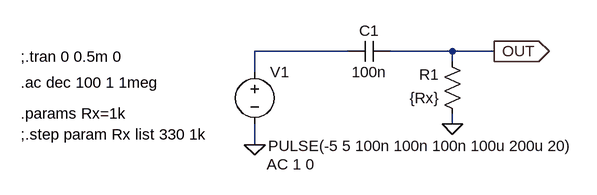
[diagram p0: schematic CR.asc]
CR.asc, the LTspice schematic file:
Version 4
SHEET 1 880 680
WIRE 96 112 -48 112
WIRE 256 112 160 112
WIRE 320 112 256 112
WIRE 256 128 256 112
WIRE -48 144 -48 112
WIRE 256 224 256 208
WIRE -48 256 -48 224
FLAG 256 224 0
FLAG -48 256 0
FLAG 320 112 OUT
IOPIN 320 112 Out
SYMBOL res 272 224 R180
WINDOW 0 36 76 Left 2
WINDOW 3 36 40 Left 2
SYMATTR InstName R1
SYMATTR Value {Rx}
SYMATTR SpiceLine pwr=1m
SYMBOL cap 160 96 R90
WINDOW 0 0 32 VBottom 2
WINDOW 3 32 32 VTop 2
SYMATTR InstName C1
SYMATTR Value 100n
SYMBOL voltage -48 128 R0
WINDOW 3 21 130 Left 2
WINDOW 123 18 158 Left 2
WINDOW 39 0 0 Left 2
SYMATTR Value PULSE(-5 5 100n 100n 100n 100u 200u 20)
SYMATTR Value2 AC 1 0
SYMATTR InstName V1
TEXT -408 120 Left 2 !;.tran 0 0.5m 0
TEXT -408 208 Left 2 !.params Rx=1k
TEXT -408 240 Left 2 !;.step param Rx list 330 1k
TEXT -408 160 Left 2 !.ac dec 100 1 1meg

The netlist it stands for:
* CR.asc
R1 0 OUT {Rx} pwr=1m
C1 OUT N001 100n
V1 N001 0 PULSE(-5 5 100n 100n 100n 100u 200u 20) AC 1 0
;.tran 0 0.5m 0
.params Rx=1k
;.step param Rx list 330 1k
.ac dec 100 1 1meg
.backanno
.end